# Altium schematic sheet IO Supply Filter.SchDoc (part 1 of 4)
size 420 x 297 mm; Author: ALTIUM GOSTBOM2.0 KEV; SheetNumber: 19; SheetTotal: 48
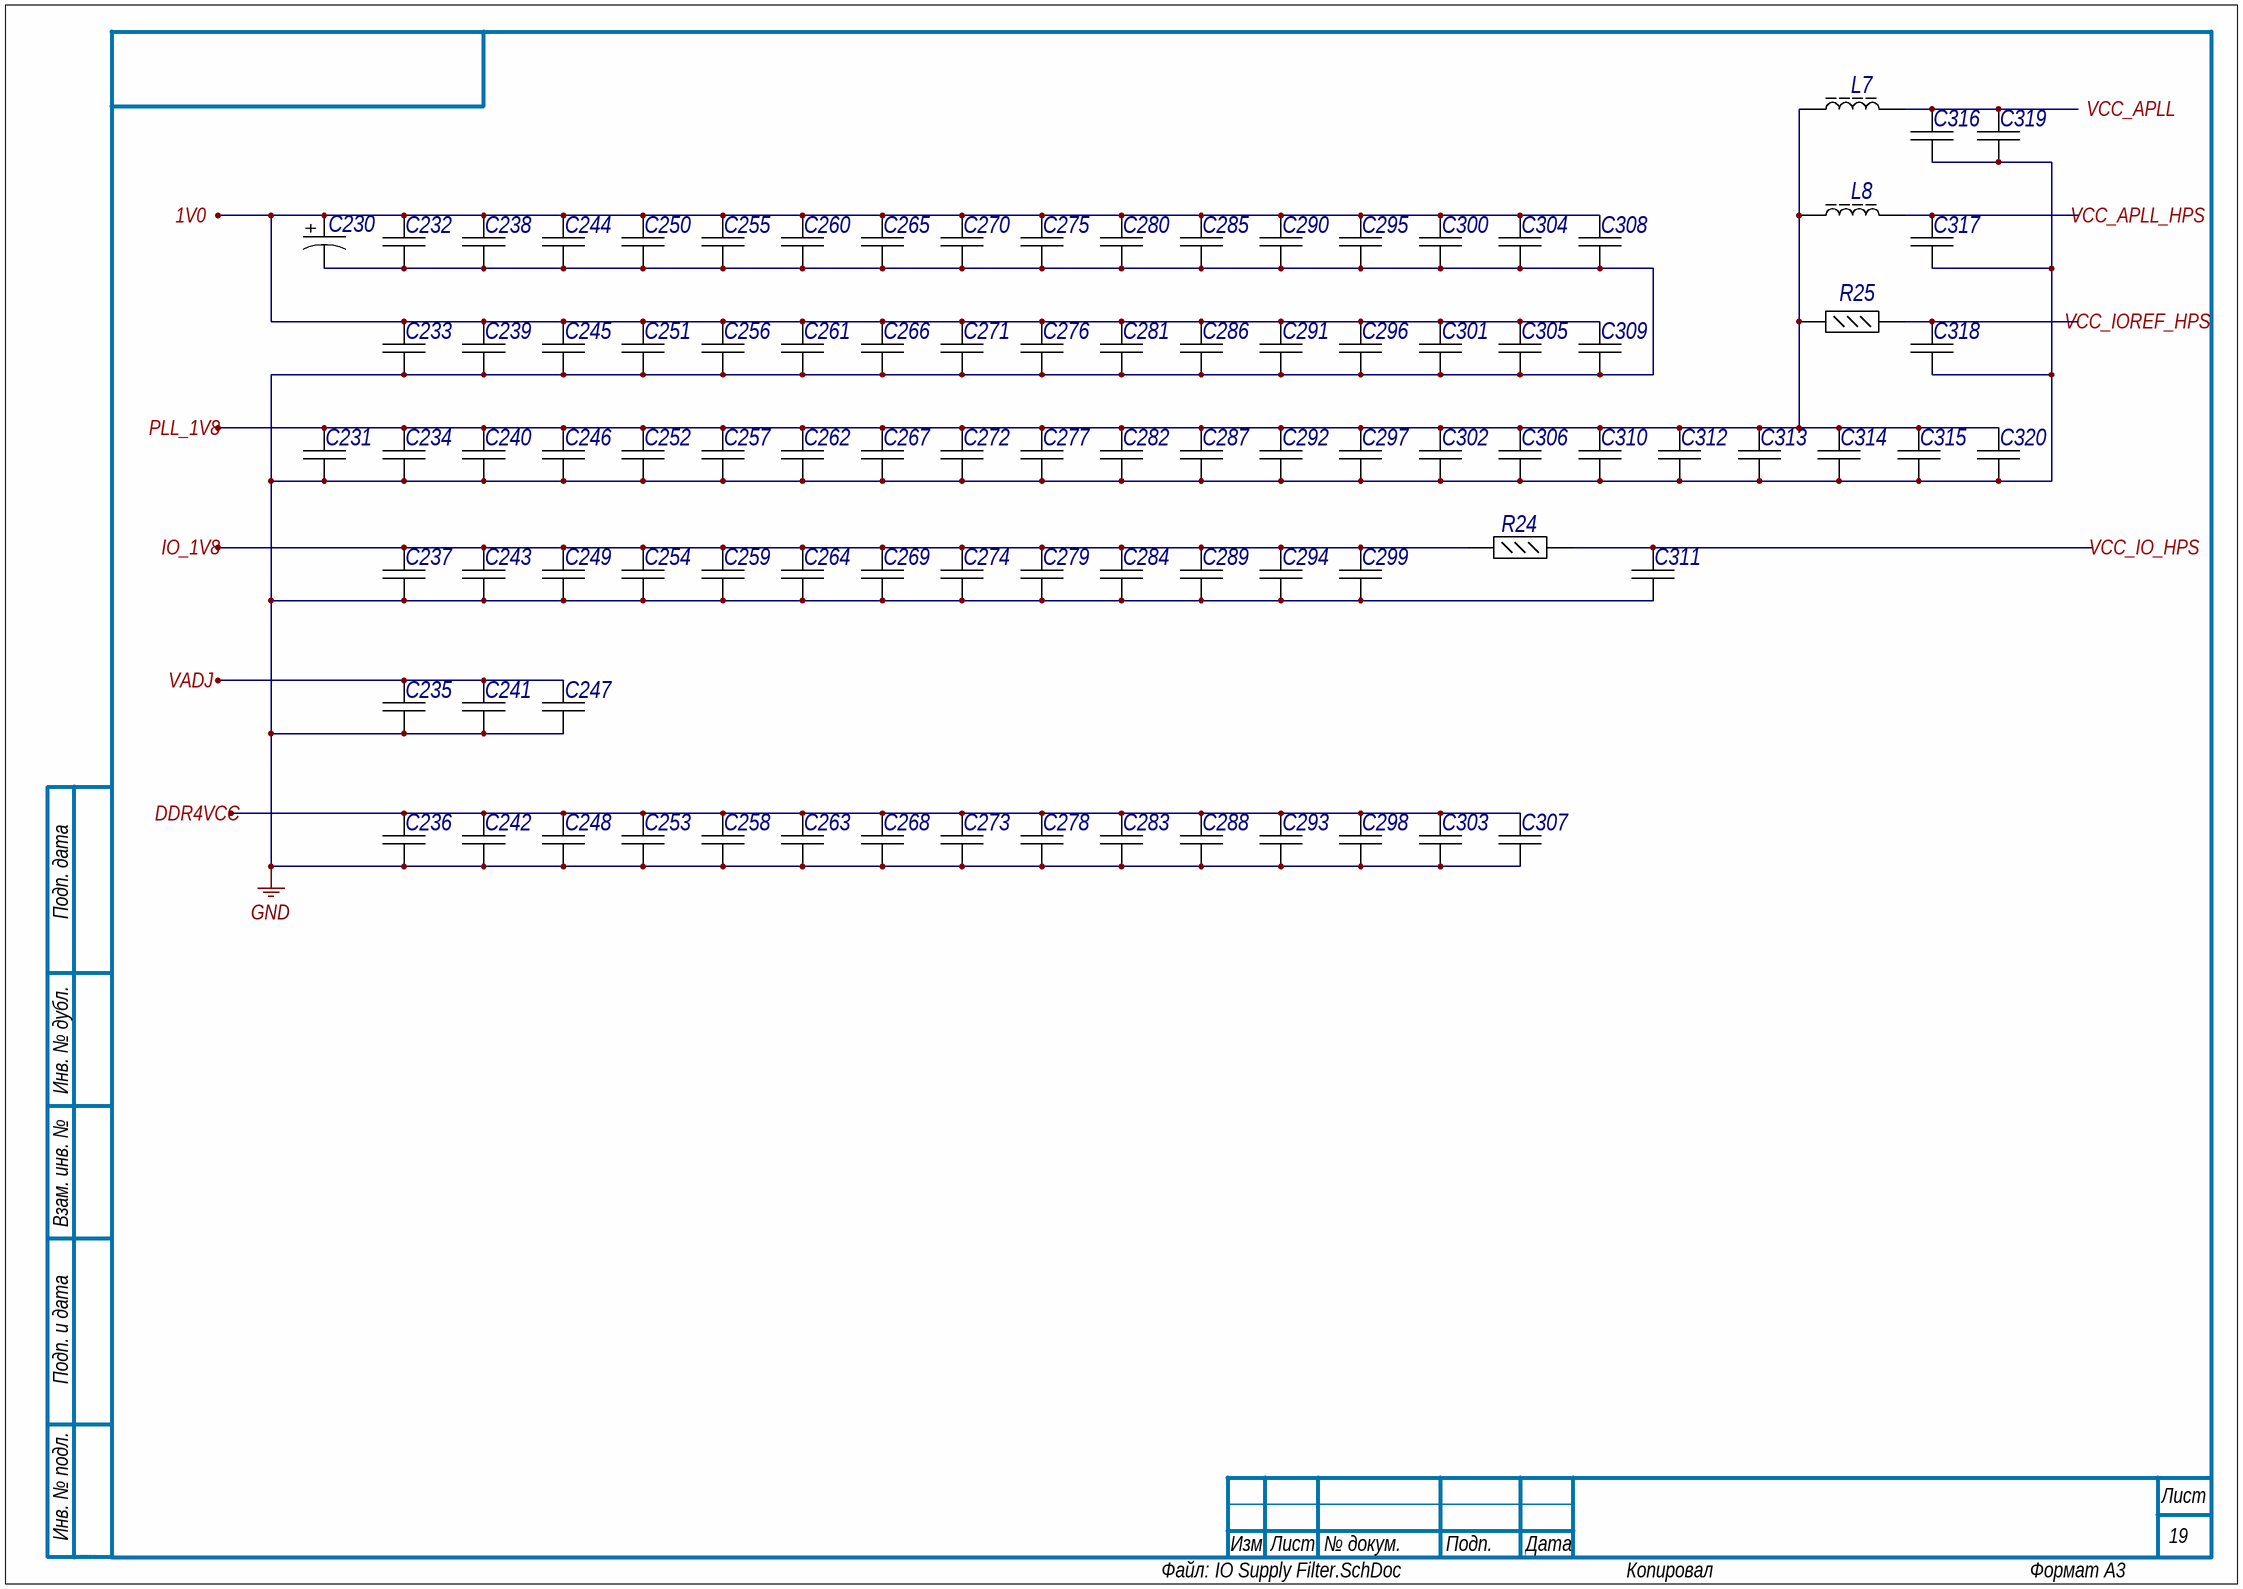
[diagram p0: IO Supply Filter.SchDoc]

## Parts
C230  T520B337M2R5ATE045  [KEMT-520-B-2_M]  (value not drawn)
C231  GRM31CR60J107ME39L  [CAPC3216X190X55ML30T25]  (value not drawn)
C232  GRM033R60J104KE19D  [CAPC0603X33X15LL03T05]  (value not drawn)
C233  GRM155R60J475ME87D  [CAPC1005X55X25LL05T10]  (value not drawn)
C234  GRM033R60J104KE19D  [CAPC0603X33X15LL03T05]  (value not drawn)
C235  GRM033R60J104KE19D  [CAPC0603X33X15LL03T05]  (value not drawn)
C236  GRM033R60J104KE19D  [CAPC0603X33X15LL03T05]  (value not drawn)
C237  GRM033R60J104KE19D  [CAPC0603X33X15LL03T05]  (value not drawn)
C238  GRM033R60J104KE19D  [CAPC0603X33X15LL03T05]  (value not drawn)
C239  GRM155R60J475ME87D  [CAPC1005X55X25LL05T10]  (value not drawn)
C240  GRM033R60J104KE19D  [CAPC0603X33X15LL03T05]  (value not drawn)
C241  GRM033R60J104KE19D  [CAPC0603X33X15LL03T05]  (value not drawn)
C242  GRM033R60J104KE19D  [CAPC0603X33X15LL03T05]  (value not drawn)
C243  GRM033R60J104KE19D  [CAPC0603X33X15LL03T05]  (value not drawn)
C244  GRM033R60J104KE19D  [CAPC0603X33X15LL03T05]  (value not drawn)
C245  GRM155R60J475ME87D  [CAPC1005X55X25LL05T10]  (value not drawn)
C246  GRM033R60J104KE19D  [CAPC0603X33X15LL03T05]  (value not drawn)
C247  GRM033R60J104KE19D  [CAPC0603X33X15LL03T05]  (value not drawn)
C248  GRM033R60J104KE19D  [CAPC0603X33X15LL03T05]  (value not drawn)
C249  GRM033R60J104KE19D  [CAPC0603X33X15LL03T05]  (value not drawn)
C250  GRM033R60J104KE19D  [CAPC0603X33X15LL03T05]  (value not drawn)
C251  GRM155R60J475ME87D  [CAPC1005X55X25LL05T10]  (value not drawn)
C252  GRM033R60J104KE19D  [CAPC0603X33X15LL03T05]  (value not drawn)
C253  GRM033R60J104KE19D  [CAPC0603X33X15LL03T05]  (value not drawn)
C254  GRM033R60J104KE19D  [CAPC0603X33X15LL03T05]  (value not drawn)
C255  GRM033R60J104KE19D  [CAPC0603X33X15LL03T05]  (value not drawn)
C256  GRM155R60J475ME87D  [CAPC1005X55X25LL05T10]  (value not drawn)
C257  GRM033R60J104KE19D  [CAPC0603X33X15LL03T05]  (value not drawn)
C258  GRM033R60J104KE19D  [CAPC0603X33X15LL03T05]  (value not drawn)
C259  GRM033R60J104KE19D  [CAPC0603X33X15LL03T05]  (value not drawn)
C260  GRM033R60J104KE19D  [CAPC0603X33X15LL03T05]  (value not drawn)
C261  GRM155R60J475ME87D  [CAPC1005X55X25LL05T10]  (value not drawn)
C262  GRM033R60J104KE19D  [CAPC0603X33X15LL03T05]  (value not drawn)
C263  GRM033R60J104KE19D  [CAPC0603X33X15LL03T05]  (value not drawn)
C264  GRM033R60J104KE19D  [CAPC0603X33X15LL03T05]  (value not drawn)
C265  GRM033R60J104KE19D  [CAPC0603X33X15LL03T05]  (value not drawn)
C266  GRM155R60J475ME87D  [CAPC1005X55X25LL05T10]  (value not drawn)
C267  GRM033R60J104KE19D  [CAPC0603X33X15LL03T05]  (value not drawn)
C268  GRM033R60J104KE19D  [CAPC0603X33X15LL03T05]  (value not drawn)
C269  GRM033R60J104KE19D  [CAPC0603X33X15LL03T05]  (value not drawn)
C270  GRM033R60J104KE19D  [CAPC0603X33X15LL03T05]  (value not drawn)
C271  GRM155R60J475ME87D  [CAPC1005X55X25LL05T10]  (value not drawn)
C272  GRM033R60J104KE19D  [CAPC0603X33X15LL03T05]  (value not drawn)
C273  GRM033R60J104KE19D  [CAPC0603X33X15LL03T05]  (value not drawn)
C274  GRM033R60J104KE19D  [CAPC0603X33X15LL03T05]  (value not drawn)
C275  GRM033R60J104KE19D  [CAPC0603X33X15LL03T05]  (value not drawn)
C276  GRM155R60J475ME87D  [CAPC1005X55X25LL05T10]  (value not drawn)
C277  GRM033R60J104KE19D  [CAPC0603X33X15LL03T05]  (value not drawn)
C278  GRM033R60J104KE19D  [CAPC0603X33X15LL03T05]  (value not drawn)
C279  GRM033R60J104KE19D  [CAPC0603X33X15LL03T05]  (value not drawn)
C280  GRM033R60J104KE19D  [CAPC0603X33X15LL03T05]  (value not drawn)
C281  GRM155R60J475ME87D  [CAPC1005X55X25LL05T10]  (value not drawn)
C282  GRM033R60J104KE19D  [CAPC0603X33X15LL03T05]  (value not drawn)
C283  GRM033R60J104KE19D  [CAPC0603X33X15LL03T05]  (value not drawn)
C284  GRM033R60J104KE19D  [CAPC0603X33X15LL03T05]  (value not drawn)
C285  GRM033R60J104KE19D  [CAPC0603X33X15LL03T05]  (value not drawn)
C286  GRM155R60J475ME87D  [CAPC1005X55X25LL05T10]  (value not drawn)
C287  GRM033R60J104KE19D  [CAPC0603X33X15LL03T05]  (value not drawn)
C288  GRM033R60J104KE19D  [CAPC0603X33X15LL03T05]  (value not drawn)
C289  GRM033R60J104KE19D  [CAPC0603X33X15LL03T05]  (value not drawn)
C290  GRM033R60J104KE19D  [CAPC0603X33X15LL03T05]  (value not drawn)
C291  GRM155R60J475ME87D  [CAPC1005X55X25LL05T10]  (value not drawn)
C292  GRM033R60J104KE19D  [CAPC0603X33X15LL03T05]  (value not drawn)
C293  GRM033R60J104KE19D  [CAPC0603X33X15LL03T05]  (value not drawn)
C294  GRM033R60J104KE19D  [CAPC0603X33X15LL03T05]  (value not drawn)
C295  GRM033R60J104KE19D  [CAPC0603X33X15LL03T05]  (value not drawn)
C296  GRM155R60J475ME87D  [CAPC1005X55X25LL05T10]  (value not drawn)
C297  GRM033R60J104KE19D  [CAPC0603X33X15LL03T05]  (value not drawn)
C298  GRM033R60J104KE19D  [CAPC0603X33X15LL03T05]  (value not drawn)
C299  GRM033R60J104KE19D  [CAPC0603X33X15LL03T05]  (value not drawn)
C300  GRM033R60J104KE19D  [CAPC0603X33X15LL03T05]  (value not drawn)
C301  GRM155R60J475ME87D  [CAPC1005X55X25LL05T10]  (value not drawn)
C302  GRM033R60J104KE19D  [CAPC0603X33X15LL03T05]  (value not drawn)
C303  GRM033R60J104KE19D  [CAPC0603X33X15LL03T05]  (value not drawn)
C304  GRM033R60J104KE19D  [CAPC0603X33X15LL03T05]  (value not drawn)
C305  GRM155R60J475ME87D  [CAPC1005X55X25LL05T10]  (value not drawn)
C306  GRM033R60J104KE19D  [CAPC0603X33X15LL03T05]  (value not drawn)
C307  GRM033R60J104KE19D  [CAPC0603X33X15LL03T05]  (value not drawn)
C308  GRM033R60J104KE19D  [CAPC0603X33X15LL03T05]  (value not drawn)
C309  GRM155R60J475ME87D  [CAPC1005X55X25LL05T10]  (value not drawn)
C310  GRM033R60J104KE19D  [CAPC0603X33X15LL03T05]  (value not drawn)
C311  GRM033R60J104KE19D  [CAPC0603X33X15LL03T05]  (value not drawn)
C312  GRM033R60J104KE19D  [CAPC0603X33X15LL03T05]  (value not drawn)
C313  GRM033R60J104KE19D  [CAPC0603X33X15LL03T05]  (value not drawn)
C314  GRM033R60J104KE19D  [CAPC0603X33X15LL03T05]  (value not drawn)
C315  GRM033R60J104KE19D  [CAPC0603X33X15LL03T05]  (value not drawn)
C316  GRM033R60J104KE19D  [CAPC0603X33X15LL03T05]  (value not drawn)
C317  GRM033R60J104KE19D  [CAPC0603X33X15LL03T05]  (value not drawn)
C318  GRM033R60J104KE19D  [CAPC0603X33X15LL03T05]  (value not drawn)
C319  GRM033R60J104KE19D  [CAPC0603X33X15LL03T05]  (value not drawn)
C320  GRM033R60J104KE19D  [CAPC0603X33X15LL03T05]  (value not drawn)
L7  742792609  [SMD-0603]  (value not drawn)
L8  742792609  [SMD-0603]  (value not drawn)
R24  ERJ-2GE0R00X  [RESC1005X40X25LL05T05]  (value not drawn)
R25  ERJ-2GE0R00X  [RESC1005X40X25LL05T05]  (value not drawn)

## Ports
1V0, DDR4VCC, IO_1V8, PLL_1V8, VADJ, VCC_APLL, VCC_APLL_HPS, VCC_IO_HPS, VCC_IOREF_HPS

## Nets
GND: C230.2 C231.1 C232.1 C233.1 C234.1 C235.1 C236.1 C237.1 C238.1 C239.1 C240.1 C241.1 C242.1 C243.1 C244.1 C245.1 C246.1 C247.1 C248.1 C249.1 C250.1 C251.1 C252.1 C253.1 C254.1 C255.1 C256.1 C257.1 C258.1 C259.1 C260.1 C261.1 C262.1 C263.1 C264.1 C265.1 C266.1 C267.1 C268.1 C269.1 C270.1 C271.1 C272.1 C273.1 C274.1 C275.1 C276.1 C277.1 C278.1 C279.1 C280.1 C281.1 C282.1 C283.1 C284.1 C285.1 C286.1 C287.1 C288.1 C289.1 C290.1 C291.1 C292.1 C293.1 C294.1 C295.1 C296.1 C297.1 C298.1 C299.1 C300.1 C301.1 C302.1 C303.1 C304.1 C305.1 C306.1 C307.1 C308.1 C309.1 C310.1 C311.1 C312.1 C313.1 C314.1 C315.1 C316.1 C317.1 C318.1 C319.1 C320.1
1V0: C230.1 C232.2 C233.2 C238.2 C239.2 C244.2 C245.2 C250.2 C251.2 C255.2 C256.2 C260.2 C261.2 C265.2 C266.2 C270.2 C271.2 C275.2 C276.2 C280.2 C281.2 C285.2 C286.2 C290.2 C291.2 C295.2 C296.2 C300.2 C301.2 C304.2 C305.2 C308.2 C309.2 ; port 1V0
DDR4VCC: C236.2 C242.2 C248.2 C253.2 C258.2 C263.2 C268.2 C273.2 C278.2 C283.2 C288.2 C293.2 C298.2 C303.2 C307.2 ; port DDR4VCC
IO_1V8: C237.2 C243.2 C249.2 C254.2 C259.2 C264.2 C269.2 C274.2 C279.2 C284.2 C289.2 C294.2 C299.2 R24.1 ; port IO_1V8
PLL_1V8: C231.2 C234.2 C240.2 C246.2 C252.2 C257.2 C262.2 C267.2 C272.2 C277.2 C282.2 C287.2 C292.2 C297.2 C302.2 C306.2 C310.2 C312.2 C313.2 C314.2 C315.2 C320.2 L7.1 L8.1 R25.1 ; port PLL_1V8
VADJ: C235.2 C241.2 C247.2 ; port VADJ
VCC_APLL: C316.2 C319.2 L7.2 ; port VCC_APLL
VCC_APLL_HPS: C317.2 L8.2 ; port VCC_APLL_HPS
VCC_IO_HPS: C311.2 R24.2 ; port VCC_IO_HPS
VCC_IOREF_HPS: C318.2 R25.2 ; port VCC_IOREF_HPS

## Notes on the sheet
- Подп. дата
- Инв. № дубл.
- Взам. инв. №
- Подп. и дата
- Инв. № подл.
- Изм.
- Лист
- № докум.
- Подп.
- Дата
- ALTIUM GOSTBOM2.0 KEV
- Файл:
- Копировал
- Формат А3
- (in symbol E26) +